# Altium schematic sheet USB_3.0.schdoc
size 127 x 101 mm
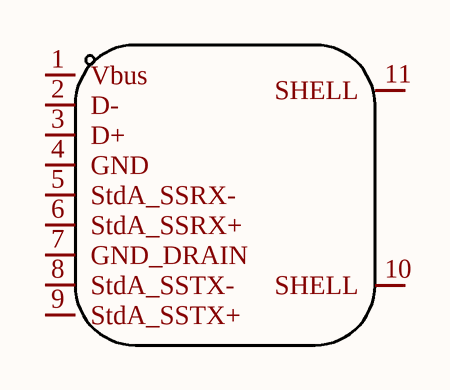
[diagram p0: USB_3.0.schdoc]

## Parts
USB?  HC-ST-003-01-J  [USB-3.0-A-TH_HC-ST-003-01-Z]  (value not drawn)

## Nets

Not connected (* = marked no-connect by the designer): USB? 1(Vbus) 2(D-) 3(D+) 4(GND) 5(StdA_SSRX-) 6(StdA_SSRX+) 7(GND_DRAIN) 8(StdA_SSTX-) 9(StdA_SSTX+) 10(SHELL) 11(SHELL)

## Library data of the parts
USB? = HC-ST-003-01-J: Add into BOM: yes; Connector Type: Type-A; Number of Ports: 1; Number of Contacts: 9P; Current Rating - Power (Max): 1.5A; Symbol: HC-ST-003-01-J; Device: HC-ST-003-01-J; Supplier: LCSC; Supplier Part: C2845330; Manufacturer Part: HC-ST-003-01-J; JLCPCB Part Class: Extended Part; Datasheet: https://atta.szlcsc.com/upload/public/pdf/source/20221116/DADAB294700AAF55209BD8638F95257E.pdf; Convert to PCB: yes; Standard: USB 3.0